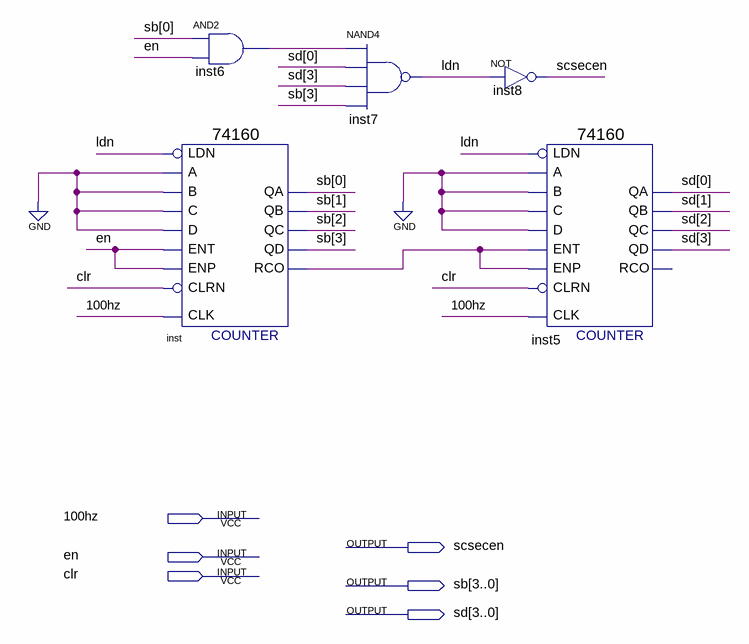
[diagram p0: schematic sheet]
// Quartus schematic mode100.bdf as structural Verilog: 5 symbols, 6 pins
module mode100 (
  input  \100hz ,
  input  en,
  input  clr,
  output scsecen,
  output [3:0] sb,
  output [3:0] sd
);

  wire inst6_out, inst_rco, ldn;

  \74160  inst (
    .CLK(\100hz ), .ENT(en), .A(1'b0), .B(1'b0), .C(1'b0), .D(1'b0), .LDN(ldn), .ENP(en), .CLRN(clr),
    .QD(sb[3]), .QA(sb[0]), .QB(sb[1]), .QC(sb[2]), .RCO(inst_rco));
  and inst6 (inst6_out, sb[0], en);
  nand inst7 (ldn, inst6_out, sd[0], sd[3], sb[3]);
  not inst8 (scsecen, ldn);
  \74160  inst5 (
    .CLK(\100hz ), .ENT(inst_rco), .A(1'b0), .B(1'b0), .C(1'b0), .D(1'b0), .LDN(ldn), .ENP(inst_rco),
    .CLRN(clr), .QD(sd[3]), .QA(sd[0]), .QB(sd[1]), .QC(sd[2]));  // open: RCO
endmodule
